# EAGLE design arduino (EAGLE 7.6.0)
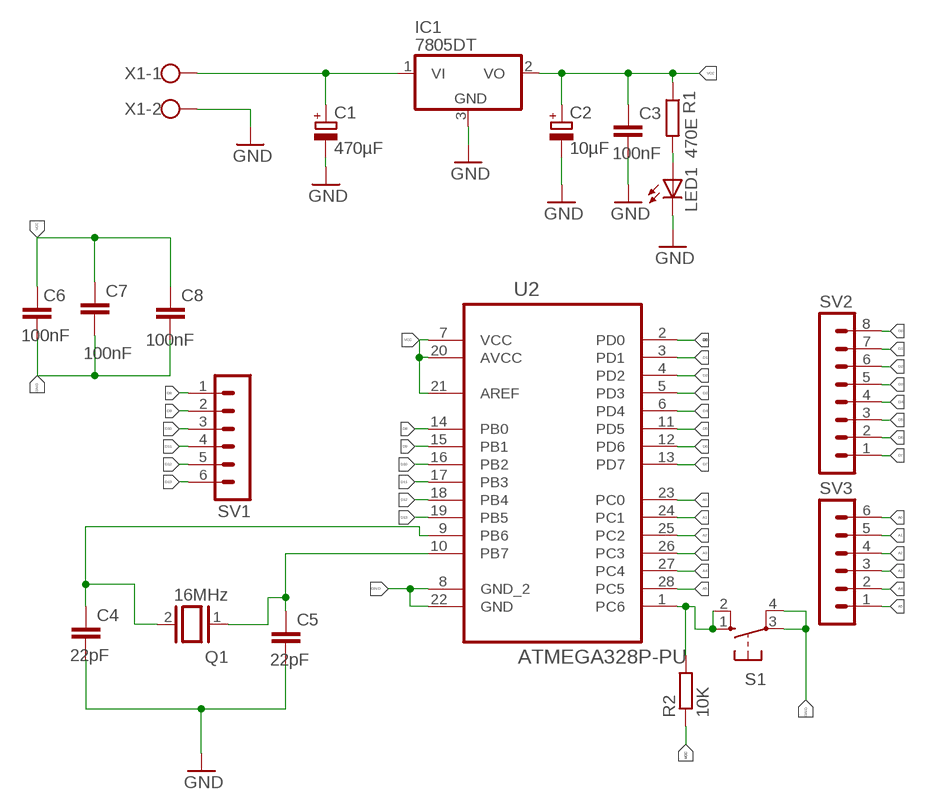
[diagram p0: schematic, sheet 1]

## Parts
C1  470µF  CPOL-EU150CLZ-1010  [150CLZ-1010]
C2  10µF  CPOL-EU150CLZ-1010  [150CLZ-1010]
C3  100nF  C-EUC1206  [C1206]
C4  22pF  C-EUC1206  [C1206]
C5  22pF  C-EUC1206  [C1206]
C6  100nF  C-EUC1206  [C1206]
C7  100nF  C-EUC1206  [C1206]
C8  100nF  C-EUC1206  [C1206]
IC1  7805DT  [TO252]
LED1  LEDSMT1206  [1206]
Q1  16MHz  XTAL/S  [QS]
R1  470E  R-EU_M1206  [M1206]
R2  10K  R-EU_R1206  [R1206]
S1  10-XX  [B3F-10XX]
SV1  MA06-1  [MA06-1]
SV2  MA08-1  [MA08-1]
SV3  MA06-1  [MA06-1]
U2  ATMEGA328P-PU  [DIP254P762X457-28]
X1  W237-102  [W237-102]

## Nets
A0: SV3.6 U2.23(PC0)
A1: SV3.5 U2.24(PC1)
A2: SV3.4 U2.25(PC2)
A3: SV3.3 U2.26(PC3)
A4: SV3.2 U2.27(PC4)
A5: SV3.1 U2.28(PC5)
D0: SV2.8 U2.2(PD0)
D1: SV2.7 U2.3(PD1)
D2: SV2.6 U2.4(PD2)
D3: SV2.5 U2.5(PD3)
D4: SV2.4 U2.6(PD4)
D5: SV2.3 U2.11(PD5)
D6: SV2.2 U2.12(PD6)
D7: SV2.1 U2.13(PD7)
D8: SV1.1 U2.14(PB0)
D9: SV1.2 U2.15(PB1)
D10: SV1.3 U2.16(PB2)
D11: SV1.4 U2.17(PB3)
D12: SV1.5 U2.18(PB4)
D13: SV1.6 U2.19(PB5)
GND: C1.- C2.- C3.2 C4.2 C5.2 C6.2 C7.2 C8.2 IC1.3(GND) LED1.C S1.3(P) S1.4(P1) U2.8(GND_2) U2.22(GND) X1.2
N$1: C1.+ IC1.1(VI) X1.1
N$2: LED1.A R1.2
N$3: C4.1 Q1.2 U2.9(PB6)
N$4: C5.1 Q1.1 U2.10(PB7)
N$6: R2.2 S1.1(S) S1.2(S1) U2.1(PC6)
VCC: C2.+ C3.1 C6.1 C7.1 C8.1 IC1.2(VO) R1.1 R2.1 U2.7(VCC) U2.20(AVCC) U2.21(AREF)

## Library data of the parts
C1 C2 = resistor:CPOL-EU: POLARIZED CAPACITOR, European symbol
C3-C8 = rcl:C-EU: CAPACITOR, European symbol
IC1 = linear:78*: Positive VOLTAGE REGULATOR Source: http://cache.national.com/ds/LM/LM78L05.pdf http://www.fairchildsemi.com/ds/LM/LM7805.pdf
LED1 = led:LED: LED OSRAM: - CHIPLED LG R971, LG N971, LY N971, LG Q971, LY Q971, LO R971, LY R971 LH N974, LH R974 LS Q976, LO Q976, LY Q976 LO Q996 - Hyper CHIPLED LW Q18S LB Q993, LB Q99A, LB R99A - SideLED LS A670, LO A670, LY A670, LG A670, LP A670 LB A673, LV A673, LT A673, LW A673 LH A674 LY A675 LS A676, LA A676, LO A676, LY A676, LW A676 LS A679, LY A679, LG A679 - Hyper Micro SIDELED® LS Y876, LA Y876, LO Y876, LY Y876 LT Y87S - SmartLED LW L88C, LW L88S LB L89C, LB L89S, LG L890 LS L89K, LO L89K, LY L89K LS L896, LA L896, LO L896, LY L896 - TOPLED LS T670, LO T670, LY T670, LG T670, LP T670 LSG T670, LSP T670, LSY T670, LOP T670, LYG T670 LG T671, LOG T671, LSG T671 LB T673, LV T673, LT T673, LW T673 LH T674 LS T676, LA T676, LO T676, LY T676, LB T676, LH T676, LSB T676, LW T676 LB T67C, LV T67C, LT T67C, LS T67K, LO T67K, LY T67K, LW E67C LS E67B, LA E67B, LO E67B, LY E67B, LB E67C, LV E67C, LT E67C LW T67C LS T679, LY T679, LG T679 LS T770, LO T770, LY T770, LG T770, LP T770 LB T773, LV T773, LT T773, LW T773 LH T774 LS E675, LA E675, LY E675, LS T675 LS T776, LA T776, LO T776, LY T776, LB T776 LHGB T686 LT T68C, LB T68C - Hyper Mini TOPLED® LB M676 - Mini TOPLED Santana® LG M470 LS M47K, LO M47K, LY M47K Source: http://www.osram.convergy.de LUXEON: - LUMILED® LXK2-PW12-R00, LXK2-PW12-S00, LXK2-PW14-U00, LXK2-PW14-V00 LXK2-PM12-R00, LXK2-PM12-S00, LXK2-PM14-U00 LXK2-PE12-Q00, LXK2-PE12-R00, LXK2-PE12-S00, LXK2-PE14-T00, LXK2-PE14-U00 LXK2-PB12-K00, LXK2-PB12-L00, LXK2-PB12-M00, LXK2-PB14-N00, LXK2-PB14-P00, LXK2-PB14-Q00 LXK2-PR12-L00, LXK2-PR12-M00, LXK2-PR14-Q00, LXK2-PR14-R00 LXK2-PD12-Q00, LXK2-PD12-R00, LXK2-PD12-S00 LXK2-PH12-R00, LXK2-PH12-S00 LXK2-PL12-P00, LXK2-PL12-Q00, LXK2-PL12-R00 Source: www.luxeon.com KINGBRIGHT: KA-3528ASYC Source: www.kingbright.com
Q1 = special:XTAL/S: CRYSTAL
R1 = resistor:R-EU_: RESISTOR, European symbol
R2 = rcl:R-EU_: RESISTOR, European symbol
S1 = switch-omron:10-XX: OMRON SWITCH; MPN: B3F-1000; OC_FARNELL: 176432; OC_NEWARK: 36M3542
SV1 SV3 = con-lstb:MA06-1: PIN HEADER; OC_FARNELL: unknown; OC_NEWARK: unknown
SV2 = con-lstb:MA08-1: PIN HEADER; OC_FARNELL: unknown; OC_NEWARK: unknown
U2 = ATMEGA328P-PU:ATMEGA328P-PU: 8-bit Microcontroller with In-System Programmable Flash; AVAILABILITY: Unavailable; DESCRIPTION: Embedded microcontroller ATMEGA328P-PU PDIP 28 Microchip Technology 8-Bit 20 MHz I/O number 23; MF: Microchip; MP: ATMEGA328P-PU; PACKAGE: PDIP-28 Microchip; PRICE: None
X1 = con-wago-500:W237-102: WAGO SCREW CLAMP; MPN: 237-102; OC_FARNELL: unknown; OC_NEWARK: 70K9898

## Board
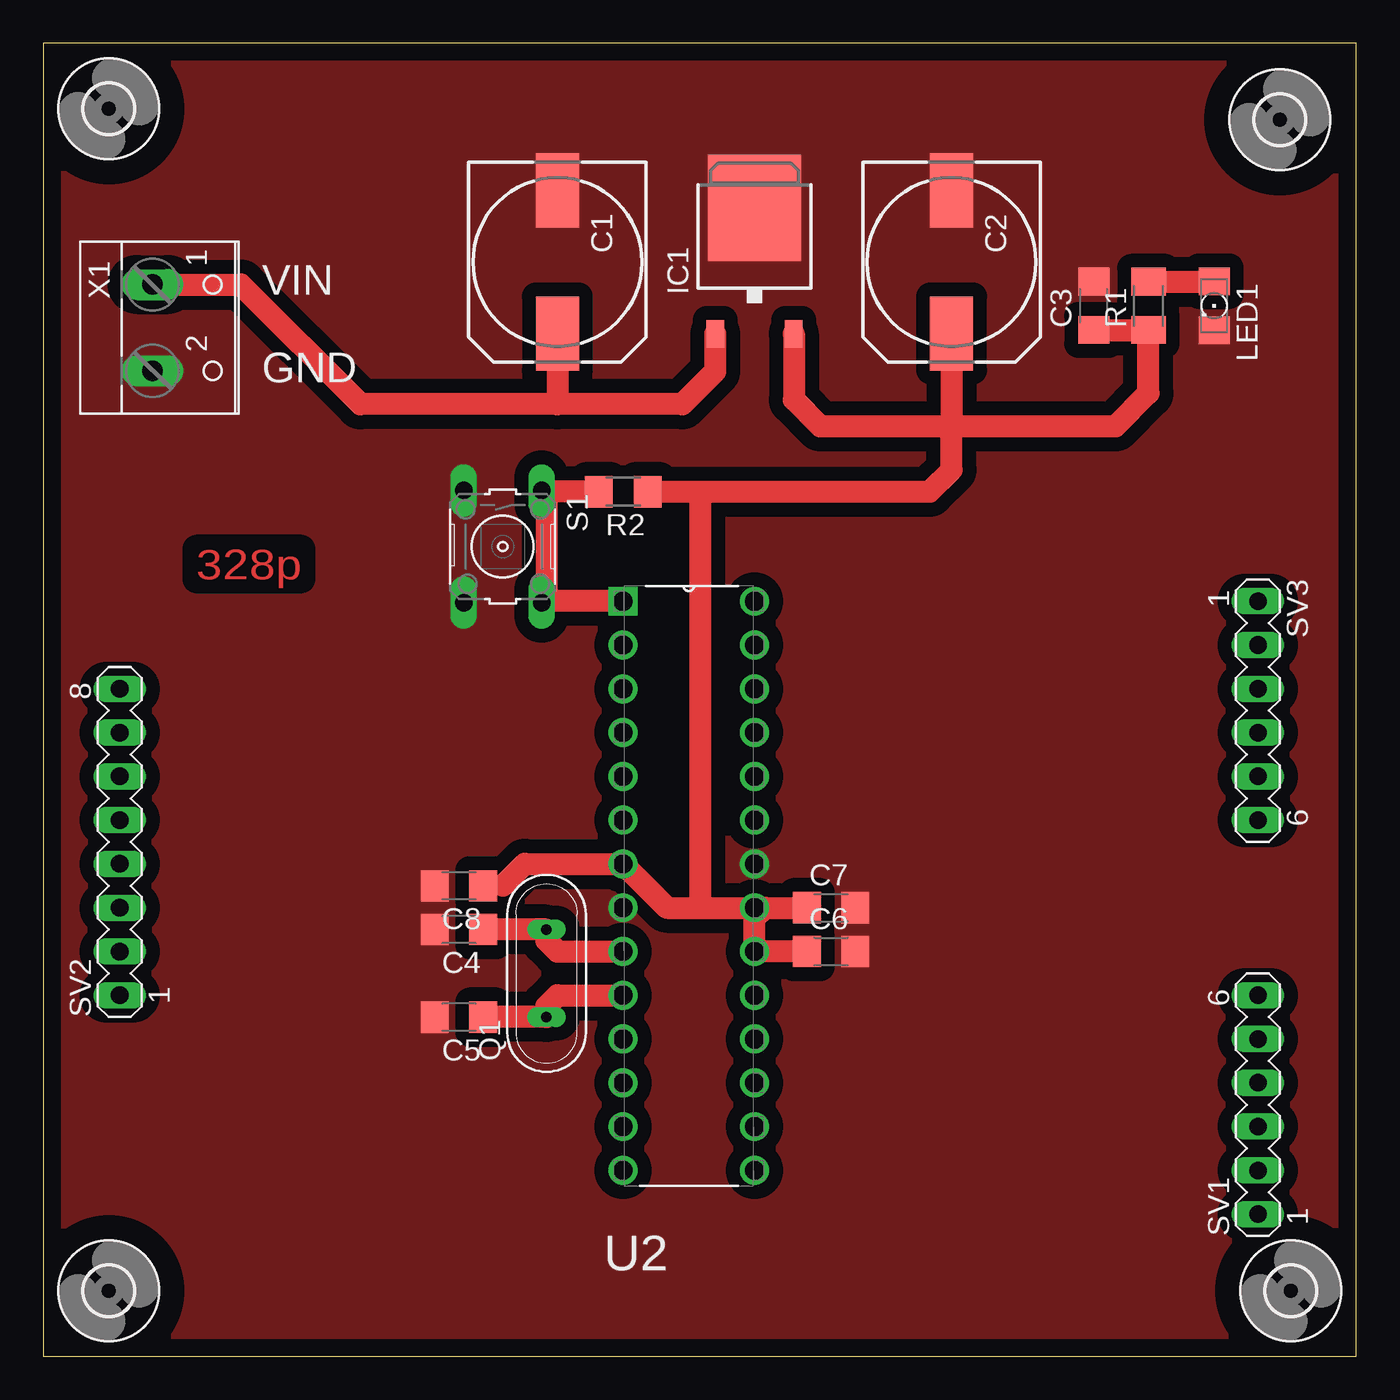
[diagram p1: board, top side]
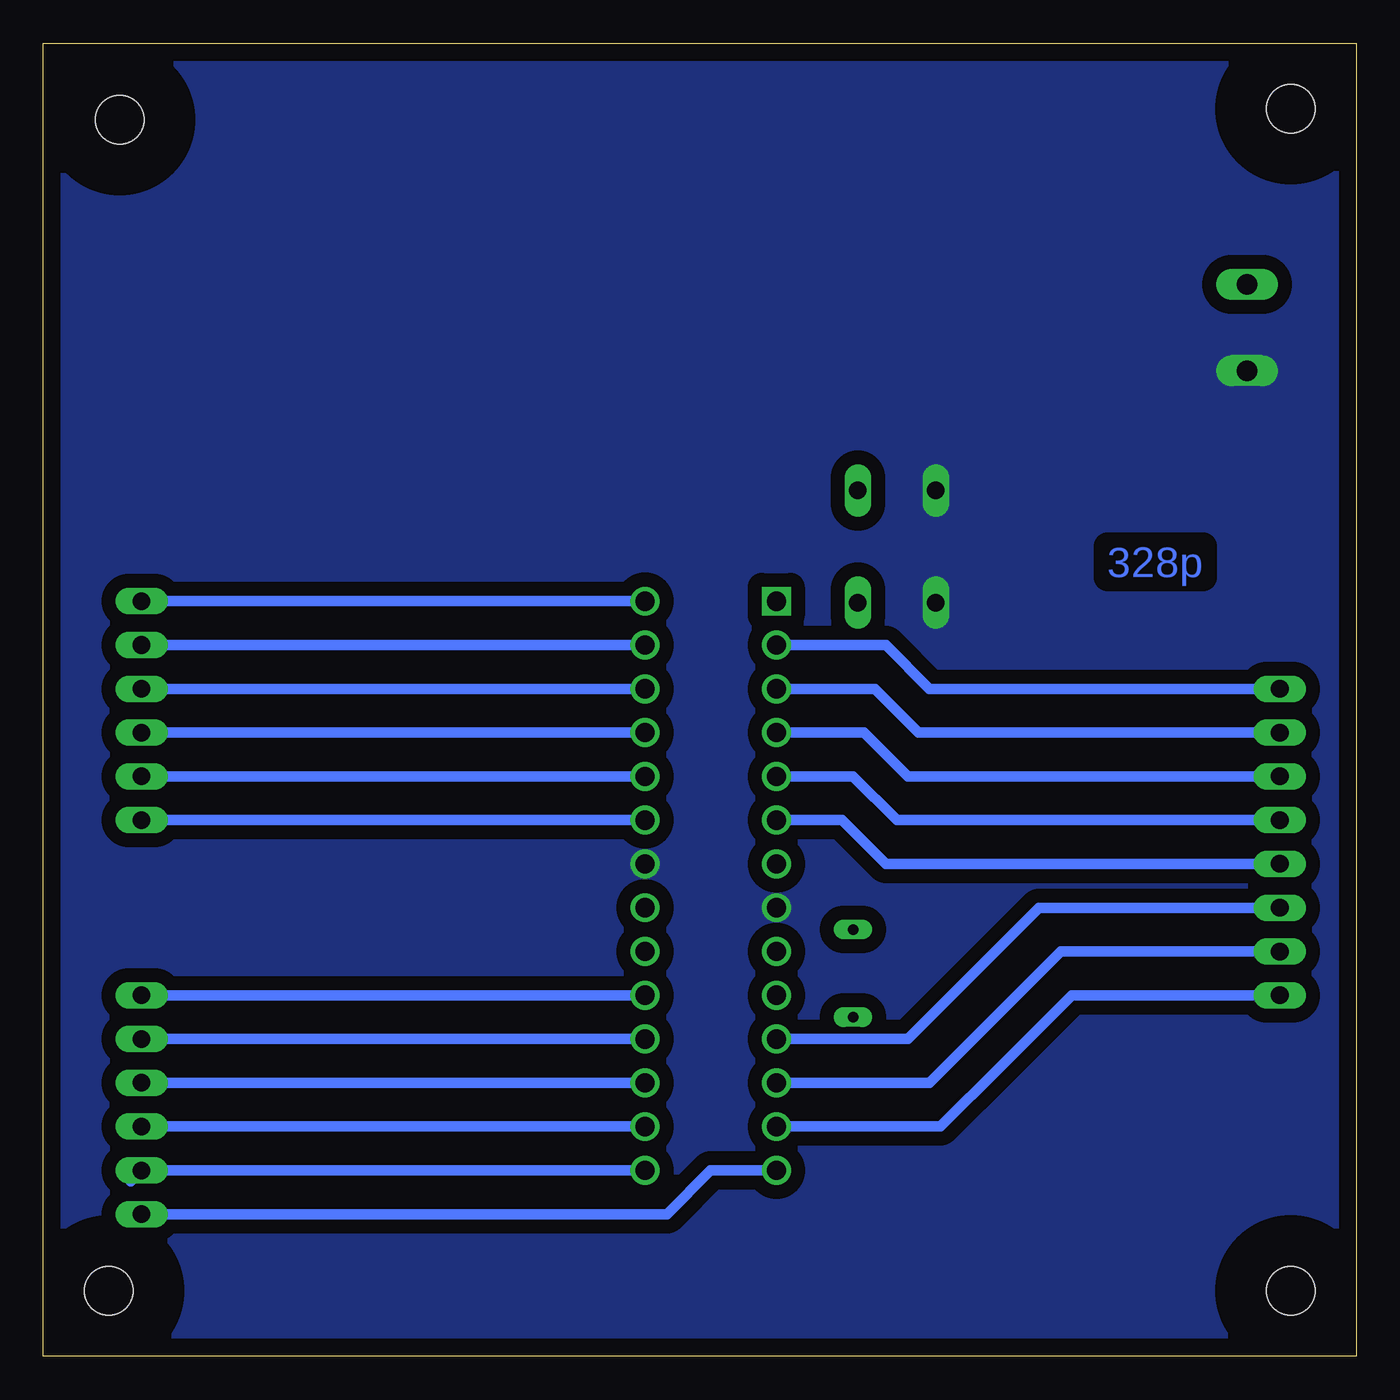
[diagram p2: board, bottom side, seen from below]

Size 76.2 x 76.2 mm. Coordinates in mm from the lower left corner, seen from the top.
Outline: 0,0 76.2,0 76.2,76.2 0,76.2 0,0
Copper layers (1*16): Top 0.035mm / dielectric 1.5mm / Bottom 0.035mm
Design rules "default": minimum track width 10mil, minimum drill 24mil, track to track 8mil, track to pad 8mil, pad to pad 8mil, via to via 8mil, smd to smd 8mil, copper to edge 40mil, drill to drill 8mil, minimum pad ring 10mil, minimum via ring 8mil, stop-mask expansion 4mil, vias tented up to drill 0mil, thermal gap 10mil

### Footprints (pad centres in the part's own frame; a part is rotated, then mirrored left to right if it is on the bottom)
150CLZ-1010 = smd 4.3 x 2.5: + 4.15,0; - -4.15,0
C1206 = smd 1.6 x 1.8: 1 -1.4,0; 2 1.4,0
TO252 = smd 1 x 1.6: 1 -2.28,-4.8; 2 2.28,-4.8 | smd 5.4 x 6.2: 3 0,2.5
1206 = smd 1.6 x 1.803: A -1.422,0; C 1.422,0
QS = drill 0.61 long: 1 -2.54,0; 2 2.54,0
M1206 = smd 1.6 x 2: 1 -1.4,0; 2 1.4,0
R1206 = smd 1.6 x 1.803: 1 -1.422,0; 2 1.422,0
B3F-10XX = drill 1.016 long: 1 -3.251,2.261; 2 3.251,2.261; 3 -3.251,-2.261; 4 3.251,-2.261
MA06-1 = drill 1.016 long: 1 -6.35,0; 2 -3.81,0; 3 -1.27,0; 4 1.27,0; 5 3.81,0; 6 6.35,0
MA08-1 = drill 1.016 long: 1 -8.89,0; 2 -6.35,0; 3 -3.81,0; 4 -1.27,0; 5 1.27,0; 6 3.81,0; 7 6.35,0; 8 8.89,0
DIP254P762X457-28 = drill 1.118 square: 1 -7.62,33.02 | drill 1.118: 2 -7.62,30.48; 3 -7.62,27.94; 4 -7.62,25.4; 5 -7.62,22.86; 6 -7.62,20.32; 7 -7.62,17.78; 8 -7.62,15.24; 9 -7.62,12.7; 10 -7.62,10.16; 11 -7.62,7.62; 12 -7.62,5.08; 13 -7.62,2.54; 14 -7.62,0; 15 0,0; 16 0,2.54; 17 0,5.08; 18 0,7.62; 19 0,10.16; 20 0,12.7; 21 0,15.24; 22 0,17.78; 23 0,20.32; 24 0,22.86; 25 0,25.4; 26 0,27.94; 27 0,30.48; 28 0,33.02
2,8 = hole 2.8: 0,0
W237-102 = drill 1.194 long: 1 -2.5,-1.27; 2 2.5,-1.27

### Placement (x,y rotation side)
C1  29.84,63.5 270 top
C2  52.7,63.5 270 top
C3  60.96,60.96 90 top
C4  24.13,24.77 180 top
C5  24.13,19.68 180 top
C6  45.72,23.5 0 top
C7  45.72,26.04 0 top
C8  24.13,27.3 180 top
IC1  41.27,64.14 0 top
LED1  67.94,60.96 270 top
Q1  29.21,22.23 90 top
R1  64.14,60.96 90 top
R2  33.66,50.16 180 top
S1  26.67,46.99 270 top
SV1  70.48,14.61 90 top
SV2  4.45,29.84 90 top
SV3  70.48,37.47 270 top
U2  41.27,10.79 0 top
U$1  [2,8]  3.81,72.39 0 top
U$2  [2,8]  71.75,71.75 0 top
U$3  [2,8]  72.39,3.81 0 top
U$4  [2,8]  3.81,3.81 0 top
X1  7.62,59.69 270 top

### Tracks (layer width: path | path; a pad name or v marks a point on that pad's centre or on a via)
A0
  Bottom 0.61: U2.23 SV3.6
A1
  Bottom 0.61: U2.24 SV3.5
A2
  Bottom 0.61: U2.25 SV3.4
A3
  Bottom 0.61: U2.26 SV3.3
A4
  Bottom 0.61: U2.27 SV3.2
A5
  Bottom 0.61: U2.28 SV3.1
D0
  Bottom 0.61: U2.2 27.3,41.27 24.77,38.73 SV2.8
D1
  Bottom 0.61: U2.3 27.94,38.73 25.4,36.2 SV2.7
D2
  Bottom 0.61: U2.4 28.57,36.2 26.04,33.66 SV2.6
D3
  Bottom 0.61: U2.5 29.21,33.66 26.67,31.11 SV2.5
D4
  Bottom 0.61: U2.6 29.84,31.11 27.3,28.57 SV2.4
D5
  Bottom 0.61: U2.11 26.04,18.41 22.86,21.59 22.23,22.23 18.41,26.04 SV2.3
D6
  Bottom 0.61: U2.12 24.77,15.88 17.14,23.5 SV2.2
D7
  Bottom 0.61: U2.13 24.13,13.34 20.64,16.83 20.32,17.14 16.51,20.95 SV2.1
D8
  Bottom 0.61: SV1.1 40.01,8.26 37.47,10.79 U2.14
D9
  Bottom 0.61: U2.15 SV1.2 71.12,10.16
D10
  Bottom 0.61: U2.16 SV1.3
D11
  Bottom 0.61: U2.17 SV1.4
D12
  Bottom 0.61: U2.18 SV1.5
D13
  Bottom 0.61: U2.19 SV1.6
GND
  pour Bottom (isolate 0.813, no thermals): 0.64,75.56 74.93,75.56 75.56,75.56 75.56,0.64 0.64,0.64
  pour Top (isolate 0.813, no thermals): 0.64,75.56 75.56,75.56 75.56,0.64 0.64,0.64
N$1
  Top 1.27: X1.1 11.47,62.19 18.41,55.24 29.84,55.24 | 29.84,55.24 37.09,55.24 38.99,57.15 IC1.1 | C1.+ 29.84,55.24
N$2
  Top 1.27: R1.2 67.92,62.36 LED1.A
N$3
  Top 0.61: Q1.2 29.21,24.13
  Top 1.27: 29.21,24.13 29.84,23.5 U2.9 | Q1.2 C4.1
N$4
  Top 1.27: U2.10 29.84,20.95 29.21,20.32 Q1.1 C5.1
N$6
  Top 0.61: S1.1 32.16,50.24 R2.2 | 29.21,44.02 S1.2 29.01,43.81
  Top 1.27: R2.2 29.21,50.16 29.21,44.02 | U2.1 29.01,43.81
VCC
  Top 0.61: C8.1 26.67,27.3
  Top 1.27: 52.69,59.34 C2.+ 52.7,53.98 | IC1.2 43.55,55.51 45.09,53.98 52.7,53.98 | 52.7,53.98 62.23,53.98 64.14,55.88 R1.1 C3.1 | 26.67,27.3 27.94,28.57 U2.7 36.2,26.04 38.1,26.04 | 41.91,26.04 U2.21 38.1,26.04 | 41.91,26.04 C7.1 | 41.91,26.04 41.27,25.4 U2.20 C6.1 | 38.1,50.16 51.44,50.16 52.7,51.44 52.7,53.98 | R2.1 38.1,50.16 | 38.1,50.16 38.1,26.04

### Text on the board
Top: 328p
Bottom: 328p
tNames: VIN | GND